# EAGLE schematic markey (EAGLE 6.0)
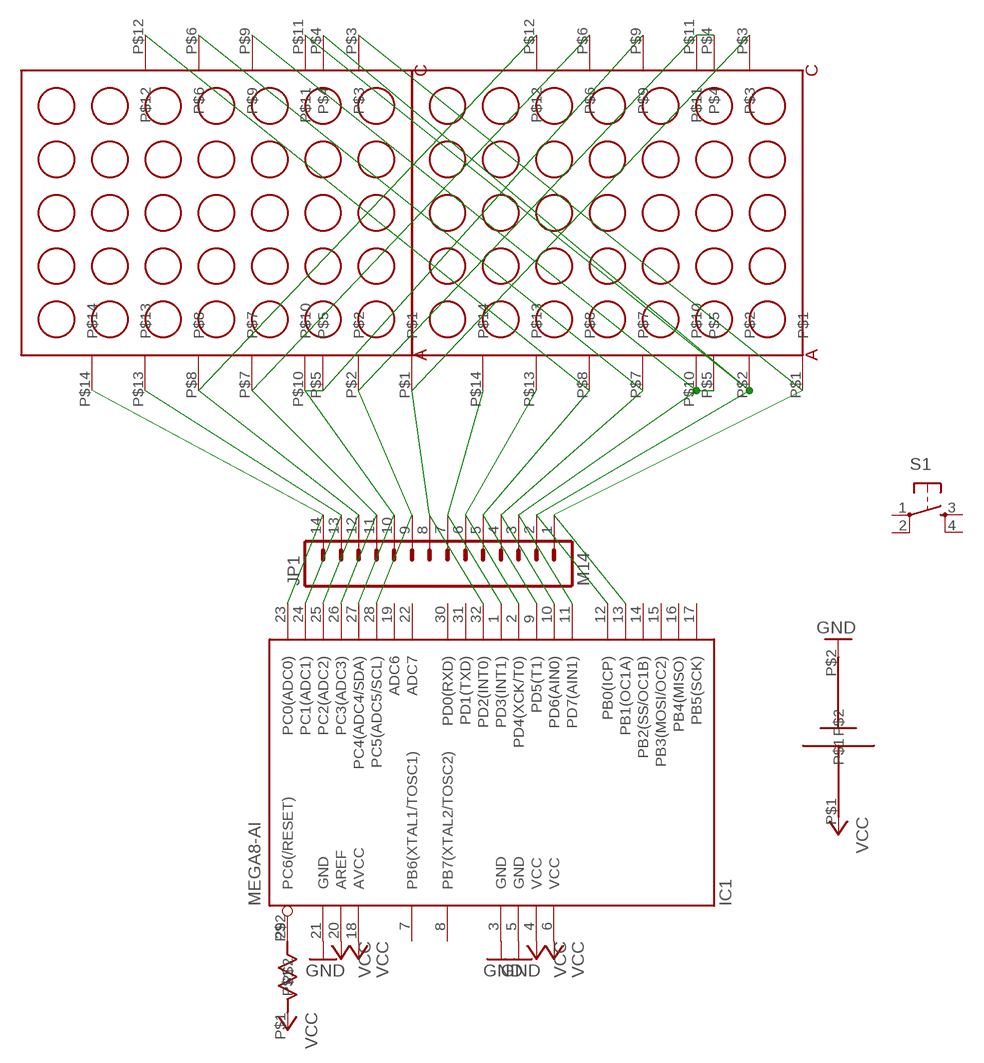
[diagram p0: schematic, sheet 1]

## Parts
IC1  MEGA8-AI  [TQFP32-08]
JP1  M14  [1X14]
S1  TAC_SWITCHPTH  [TACTILE-PTH]
U$1  5X7_SMALL_MX  [5X7]
U$2  5X7_SMALL_MX  [5X7]
U$3  R-7  [R-7]
U$4  CR2032  [CR2032_EBAY]

## Nets
GND: IC1.3(GND) IC1.5(GND) IC1.21(GND) U$4.P$2
N$1: IC1.27(PC4(ADC4/SDA)) JP1.10 U$1.P$9 U$2.P$5 U$2.P$10
N$2: IC1.28(PC5(ADC5/SCL)) JP1.9 U$1.P$4 U$1.P$11 U$2.P$2
N$3: IC1.12(PB0(ICP)) JP1.2 U$1.P$2 U$2.P$4 U$2.P$11
N$4: IC1.11(PD7(AIN1)) JP1.3 U$1.P$5 U$1.P$10 U$2.P$9
N$5: IC1.13(PB1(OC1A)) JP1.1 U$1.P$1 U$2.P$3
N$6: IC1.10(PD6(AIN0)) JP1.4 U$1.P$7 U$2.P$6
N$7: IC1.9(PD5(T1)) JP1.5 U$1.P$8 U$2.P$12
N$8: IC1.32(PD2(INT0)) JP1.8 U$1.P$3 U$2.P$1
N$9: IC1.26(PC3(ADC3)) JP1.11 U$1.P$6 U$2.P$7
N$10: IC1.25(PC2(ADC2)) JP1.12 U$1.P$12 U$2.P$8
N$11: IC1.23(PC0(ADC0)) JP1.14 U$2.P$14
N$12: IC1.24(PC1(ADC1)) JP1.13 U$2.P$13
N$13: IC1.1(PD3(INT1)) JP1.7 U$1.P$14
N$14: IC1.2(PD4(XCK/T0)) JP1.6 U$1.P$13
N$15: IC1.29(PC6(/RESET)) U$3.P$2
VCC: IC1.4(VCC) IC1.6(VCC) IC1.18(AVCC) IC1.20(AREF) U$3.P$1 U$4.P$1
Unconnected: IC1.7(PB6(XTAL1/TOSC1)) IC1.8(PB7(XTAL2/TOSC2)) IC1.14(PB2(SS/OC1B)) IC1.15(PB3(MOSI/OC2)) IC1.16(PB4(MISO)) IC1.17(PB5(SCK)) IC1.19(ADC6) IC1.22(ADC7) IC1.30(PD0(RXD)) IC1.31(PD1(TXD)) S1.1 S1.2 S1.3 S1.4

## Library data of the parts
IC1 = atmel:MEGA8: MICROCONTROLLER 8 Kbytes FLASH, 1 kbytes SRAM, 512 bytes EEPROM, USART, 6-channel 10 bit ADC, 2-channel 8 bit ADC Pin compatible with Atmega48, ATMega88, ATMega168 Source: avr.lbr; MPN: ATMEGA8-16AU; OC_FARNELL: 9171371; OC_NEWARK: 73M8863
JP1 = SparkFun-Connectors:M14: Header 14 Standard 14-pin 0.1" header. Use with straight break away headers (SKU : PRT-00116), right angle break away headers (PRT-00553), swiss pins (PRT-00743), machine pins (PRT-00117), and female headers (PRT-00115).
S1 = SparkFun:TAC_SWITCH: Momentary Switch Button commonly used for reset or general input. Spark Fun Electronics SKU : COM-00097
U$1 U$2 = Mrule:5X7_SMALL_MX
U$3 = Mrule:R-7
U$4 = Mrule:CR2032